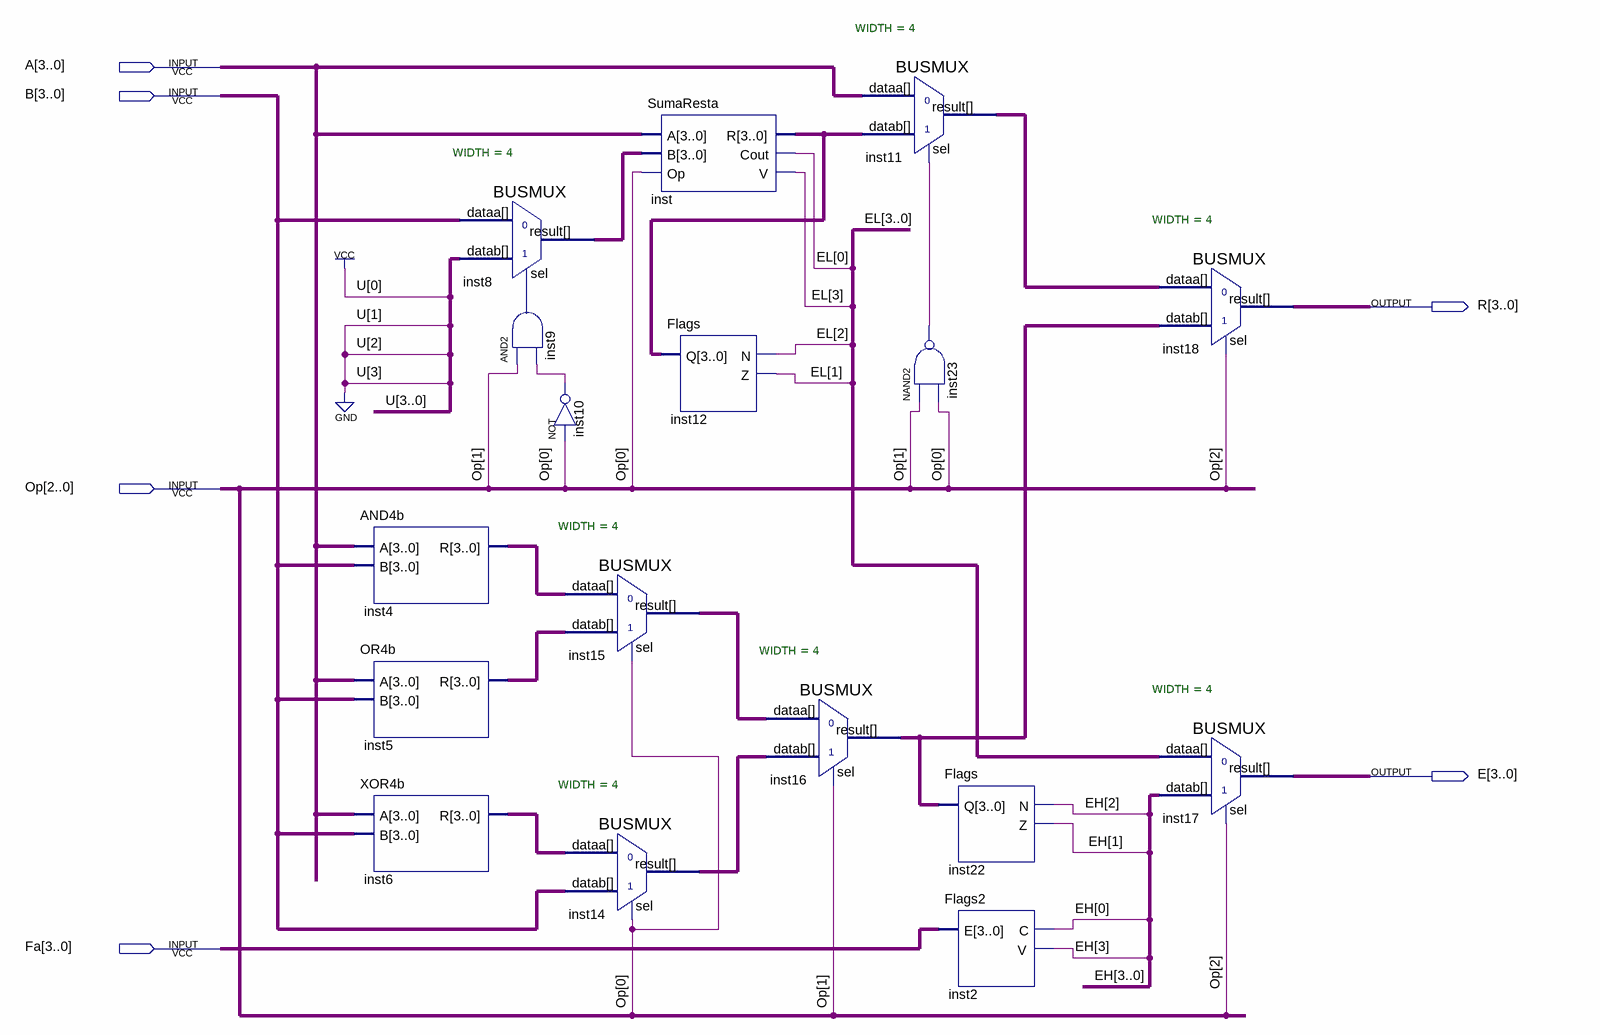
[diagram p0: schematic sheet]
// Quartus schematic ABALU.bdf as structural Verilog: 17 symbols, 6 pins
module ABALU (
  input  [3:0] A,
  input  [3:0] B,
  input  [2:0] Op,
  input  [3:0] Fa,
  output [3:0] R,
  output [3:0] E
);

  wire inst9_out, inst10_out, inst23_out;
  wire [3:0] EH, EL, inst4_r, inst5_r, inst6_r, inst8_result, inst11_result, inst14_result, inst15_result,
       inst16_result, inst_r;

  AND4b inst4 (.A(A), .B(B), .R(inst4_r));
  OR4b inst5 (.A(A), .B(B), .R(inst5_r));
  XOR4b inst6 (.A(A), .B(B), .R(inst6_r));
  BUSMUX #(.WIDTH(4)) inst8 (.datab(4'b0001), .sel(inst9_out), .dataa(B), .result(inst8_result));
  and inst9 (inst9_out, Op[1], inst10_out);
  not inst10 (inst10_out, Op[0]);
  BUSMUX #(.WIDTH(4)) inst15 (.datab(inst5_r), .sel(Op[0]), .dataa(inst4_r), .result(inst15_result));
  BUSMUX #(.WIDTH(4)) inst14 (.datab(B), .sel(Op[0]), .dataa(inst6_r), .result(inst14_result));
  SumaResta inst (.A(A), .B(inst8_result), .Op(Op[0]), .R(inst_r), .Cout(EL[0]), .V(EL[3]));
  Flags inst12 (.Q(inst_r), .N(EL[2]), .Z(EL[1]));
  BUSMUX #(.WIDTH(4)) inst16 (.datab(inst14_result), .sel(Op[1]), .dataa(inst15_result), .result(inst16_result));
  BUSMUX #(.WIDTH(4)) inst11 (.datab(inst_r), .sel(inst23_out), .dataa(A), .result(inst11_result));
  nand inst23 (inst23_out, Op[1], Op[0]);
  Flags inst22 (.Q(inst16_result), .N(EH[2]), .Z(EH[1]));
  Flags2 inst2 (.E(Fa), .C(EH[0]), .V(EH[3]));
  BUSMUX #(.WIDTH(4)) inst18 (.datab(inst16_result), .sel(Op[2]), .dataa(inst11_result), .result(R));
  BUSMUX #(.WIDTH(4)) inst17 (.datab(EH), .sel(Op[2]), .dataa(EL), .result(E));
endmodule
